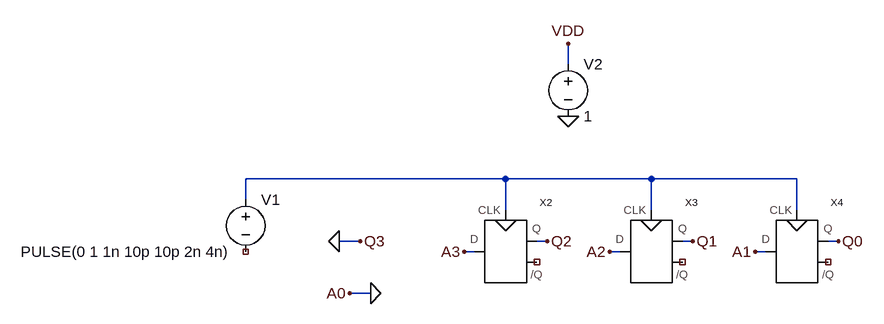
[diagram p0: schematic sequentScheme.asc]
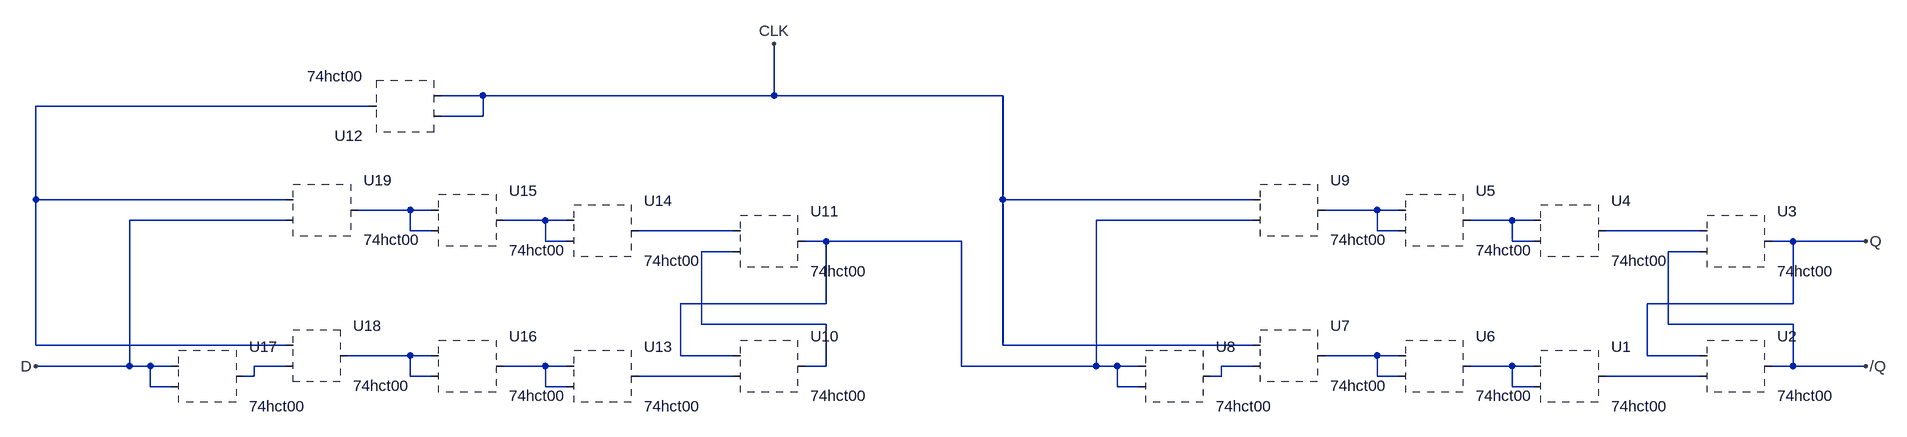
[diagram p1: sub-circuit synchdflip_flop.asc]
sequentScheme.asc, the LTspice schematic file:
Version 4
SHEET 1 980 752
WIRE 368 -128 368 -160
WIRE 272 48 -128 48
WIRE 496 48 272 48
WIRE 720 48 496 48
WIRE -128 80 -128 48
WIRE 272 96 272 48
WIRE 496 96 496 48
WIRE 720 96 720 48
WIRE 48 144 16 144
WIRE 336 144 320 144
WIRE 560 144 544 144
WIRE 784 144 768 144
WIRE 224 160 208 160
WIRE 448 160 432 160
WIRE 672 160 656 160
WIRE 64 224 32 224
FLAG 368 -160 VDD
FLAG 208 160 A3
FLAG 432 160 A2
FLAG 656 160 A1
FLAG 32 224 A0
FLAG 48 144 Q3
FLAG 336 144 Q2
FLAG 560 144 Q1
FLAG 784 144 Q0
FLAG 368 -48 0
FLAG 16 144 0
FLAG 64 224 0
SYMBOL SynchDflip_flop 272 160 R0
SYMATTR InstName X2
SYMBOL SynchDflip_flop 496 160 R0
SYMATTR InstName X3
SYMBOL SynchDflip_flop 720 160 R0
SYMATTR InstName X4
SYMBOL voltage 368 -144 R0
WINDOW 123 0 0 Left 2
WINDOW 39 0 0 Left 2
SYMATTR InstName V2
SYMATTR Value 1
SYMBOL voltage -128 64 R0
WINDOW 3 -346 96 Left 2
WINDOW 123 0 0 Left 2
WINDOW 39 0 0 Left 2
SYMATTR InstName V1
SYMATTR Value PULSE(0 1 1n 10p 10p 2n 4n)

synchdflip_flop.asc, the sub-circuit schematic file:
Version 4
SHEET 1 880 744
WIRE -1552 -112 -1616 -112
WIRE -1104 -112 -1104 -192
WIRE -1104 -112 -1552 -112
WIRE -752 -112 -1104 -112
WIRE -1728 -96 -2240 -96
WIRE -1552 -80 -1552 -112
WIRE -1552 -80 -1616 -80
WIRE -2240 48 -2240 -96
WIRE -1856 48 -2240 48
WIRE -752 48 -752 -112
WIRE -368 48 -752 48
WIRE -1664 64 -1744 64
WIRE -1632 64 -1664 64
WIRE -176 64 -256 64
WIRE -144 64 -176 64
WIRE -1856 80 -2096 80
WIRE -1456 80 -1520 80
WIRE -1424 80 -1456 80
WIRE -368 80 -608 80
WIRE 32 80 -32 80
WIRE 64 80 32 80
WIRE -1664 96 -1664 64
WIRE -1632 96 -1664 96
WIRE -1168 96 -1312 96
WIRE -176 96 -176 64
WIRE -144 96 -176 96
WIRE 320 96 176 96
WIRE -1456 112 -1456 80
WIRE -1424 112 -1456 112
WIRE -1024 112 -1056 112
WIRE -816 112 -1024 112
WIRE 32 112 32 80
WIRE 64 112 32 112
WIRE 464 112 432 112
WIRE 576 112 464 112
WIRE -1168 128 -1216 128
WIRE 320 128 272 128
WIRE -1024 208 -1024 112
WIRE -1024 208 -1248 208
WIRE 464 208 464 112
WIRE 464 208 240 208
WIRE -1216 240 -1216 128
WIRE -1024 240 -1216 240
WIRE 272 240 272 128
WIRE 464 240 272 240
WIRE -2240 272 -2240 48
WIRE -1872 272 -2240 272
WIRE -1856 272 -1872 272
WIRE -752 272 -752 48
WIRE -368 272 -752 272
WIRE -1664 288 -1760 288
WIRE -1632 288 -1664 288
WIRE -1248 288 -1248 208
WIRE -1168 288 -1248 288
WIRE -176 288 -256 288
WIRE -144 288 -176 288
WIRE 240 288 240 208
WIRE 320 288 240 288
WIRE -2096 304 -2096 80
WIRE -2096 304 -2240 304
WIRE -2064 304 -2096 304
WIRE -2032 304 -2064 304
WIRE -1872 304 -1904 304
WIRE -1856 304 -1872 304
WIRE -1456 304 -1520 304
WIRE -1424 304 -1456 304
WIRE -1024 304 -1024 240
WIRE -1024 304 -1056 304
WIRE -816 304 -816 112
WIRE -608 304 -608 80
WIRE -608 304 -816 304
WIRE -576 304 -608 304
WIRE -544 304 -576 304
WIRE -368 304 -416 304
WIRE 32 304 -32 304
WIRE 64 304 32 304
WIRE 464 304 464 240
WIRE 464 304 432 304
WIRE 576 304 464 304
WIRE -1904 320 -1904 304
WIRE -1904 320 -1920 320
WIRE -1664 320 -1664 288
WIRE -1632 320 -1664 320
WIRE -1168 320 -1312 320
WIRE -416 320 -416 304
WIRE -416 320 -432 320
WIRE -176 320 -176 288
WIRE -144 320 -176 320
WIRE 320 320 176 320
WIRE -2064 336 -2064 304
WIRE -2032 336 -2064 336
WIRE -1456 336 -1456 304
WIRE -1424 336 -1456 336
WIRE -576 336 -576 304
WIRE -544 336 -576 336
WIRE 32 336 32 304
WIRE 64 336 32 336
FLAG 576 112 Q
FLAG 576 304 /Q
FLAG -1104 -192 CLK
FLAG -2240 304 D
SYMBOL 74HCT\\74hct00 112 256 R0
SYMATTR InstName U1
SYMBOL 74HCT\\74hct00 368 240 R0
SYMATTR InstName U2
SYMBOL 74HCT\\74hct00 368 48 R0
SYMATTR InstName U3
SYMBOL 74HCT\\74hct00 112 32 R0
SYMATTR InstName U4
SYMBOL 74HCT\\74hct00 -96 16 R0
SYMATTR InstName U5
SYMBOL 74HCT\\74hct00 -96 240 R0
SYMATTR InstName U6
SYMBOL 74HCT\\74hct00 -320 224 R0
SYMATTR InstName U7
SYMBOL 74HCT\\74hct00 -496 256 R0
SYMATTR InstName U8
SYMBOL 74HCT\\74hct00 -320 0 R0
SYMATTR InstName U9
SYMBOL 74HCT\\74hct00 -1120 240 R0
SYMATTR InstName U10
SYMBOL 74HCT\\74hct00 -1120 48 R0
SYMATTR InstName U11
SYMBOL 74HCT\\74hct00 -1664 -32 R180
SYMATTR InstName U12
SYMBOL 74HCT\\74hct00 -1376 256 R0
SYMATTR InstName U13
SYMBOL 74HCT\\74hct00 -1376 32 R0
SYMATTR InstName U14
SYMBOL 74HCT\\74hct00 -1584 16 R0
SYMATTR InstName U15
SYMBOL 74HCT\\74hct00 -1584 240 R0
SYMATTR InstName U16
SYMBOL 74HCT\\74hct00 -1984 256 R0
SYMATTR InstName U17
SYMBOL 74HCT\\74hct00 -1824 224 R0
SYMATTR InstName U18
SYMBOL 74HCT\\74hct00 -1808 0 R0
SYMATTR InstName U19

The netlist it stands for:
* sequentScheme.asc
XX2 A3 N001 Q2 NC_01 synchdflip_flop
XX3 A2 N001 Q1 NC_02 synchdflip_flop
XX4 A1 N001 Q0 NC_03 synchdflip_flop
V2 VDD 0 1
V1 N001 NC_04 PULSE(0 1 1n 10p 10p 2n 4n)

* block symbol definitions
.subckt synchdflip_flop D CLK Q /Q
* U1: 74hct00 (symbol 74HCT\74hct00 not available, pin order unknown); nets seen at it: N015, N017
* U2: 74hct00 (symbol 74HCT\74hct00 not available, pin order unknown); nets seen at it: /Q, N017, Q
* U3: 74hct00 (symbol 74HCT\74hct00 not available, pin order unknown); nets seen at it: /Q, N008, Q
* U4: 74hct00 (symbol 74HCT\74hct00 not available, pin order unknown); nets seen at it: N006, N008
* U5: 74hct00 (symbol 74HCT\74hct00 not available, pin order unknown); nets seen at it: N003, N006
* U6: 74hct00 (symbol 74HCT\74hct00 not available, pin order unknown); nets seen at it: N011, N015
* U7: 74hct00 (symbol 74HCT\74hct00 not available, pin order unknown); nets seen at it: CLK, N011, N014
* U8: 74hct00 (symbol 74HCT\74hct00 not available, pin order unknown); nets seen at it: N005, N014
* U9: 74hct00 (symbol 74HCT\74hct00 not available, pin order unknown); nets seen at it: CLK, N003, N005
* U10: 74hct00 (symbol 74HCT\74hct00 not available, pin order unknown); nets seen at it: N005, N009, N016
* U11: 74hct00 (symbol 74HCT\74hct00 not available, pin order unknown); nets seen at it: N005, N007, N009
* U12: 74hct00 (symbol 74HCT\74hct00 not available, pin order unknown); nets seen at it: CLK, N001
* U13: 74hct00 (symbol 74HCT\74hct00 not available, pin order unknown); nets seen at it: N013, N016
* U14: 74hct00 (symbol 74HCT\74hct00 not available, pin order unknown); nets seen at it: N004, N007
* U15: 74hct00 (symbol 74HCT\74hct00 not available, pin order unknown); nets seen at it: N002, N004
* U16: 74hct00 (symbol 74HCT\74hct00 not available, pin order unknown); nets seen at it: N010, N013
* U17: 74hct00 (symbol 74HCT\74hct00 not available, pin order unknown); nets seen at it: D, N012
* U18: 74hct00 (symbol 74HCT\74hct00 not available, pin order unknown); nets seen at it: N001, N010, N012
* U19: 74hct00 (symbol 74HCT\74hct00 not available, pin order unknown); nets seen at it: D, N001, N002
.ends synchdflip_flop

.backanno
.end